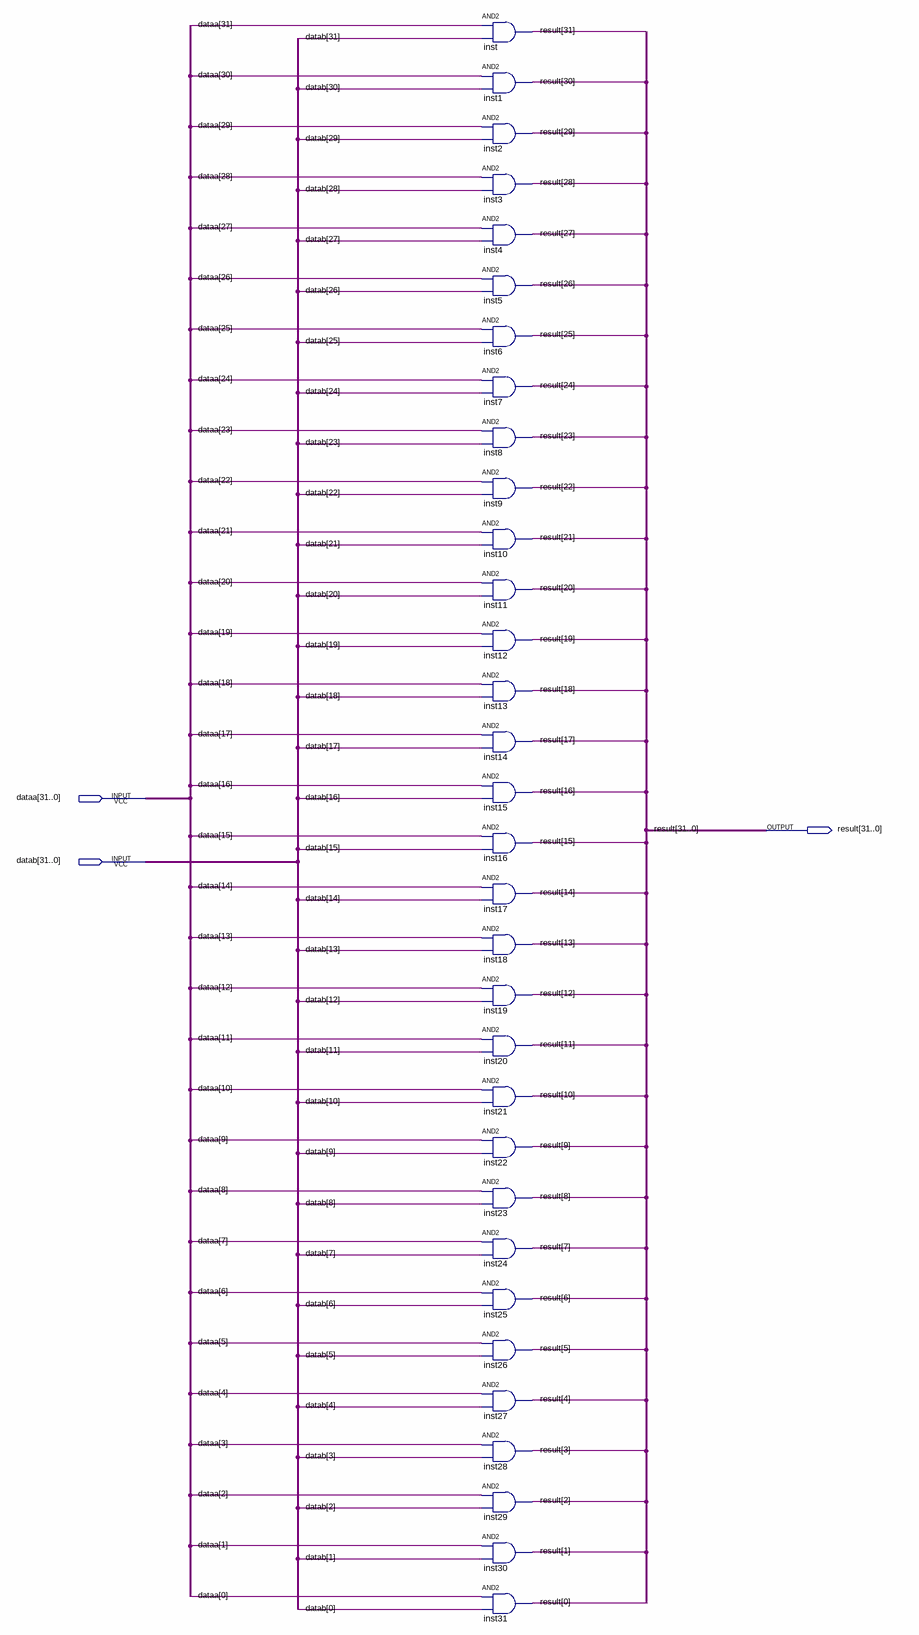
[diagram p0: schematic sheet]
// Quartus schematic ula_and.bdf as structural Verilog: 32 symbols, 3 pins
module ula_and (
  input  [31:0] dataa,
  input  [31:0] datab,
  output [31:0] result
);

  and inst (result[31], dataa[31], datab[31]);
  and inst1 (result[30], dataa[30], datab[30]);
  and inst2 (result[29], dataa[29], datab[29]);
  and inst3 (result[28], dataa[28], datab[28]);
  and inst4 (result[27], dataa[27], datab[27]);
  and inst5 (result[26], dataa[26], datab[26]);
  and inst6 (result[25], dataa[25], datab[25]);
  and inst7 (result[24], dataa[24], datab[24]);
  and inst8 (result[23], dataa[23], datab[23]);
  and inst9 (result[22], dataa[22], datab[22]);
  and inst10 (result[21], dataa[21], datab[21]);
  and inst11 (result[20], dataa[20], datab[20]);
  and inst12 (result[19], dataa[19], datab[19]);
  and inst13 (result[18], dataa[18], datab[18]);
  and inst14 (result[17], dataa[17], datab[17]);
  and inst15 (result[16], dataa[16], datab[16]);
  and inst16 (result[15], dataa[15], datab[15]);
  and inst17 (result[14], dataa[14], datab[14]);
  and inst18 (result[13], dataa[13], datab[13]);
  and inst19 (result[12], dataa[12], datab[12]);
  and inst20 (result[11], dataa[11], datab[11]);
  and inst21 (result[10], dataa[10], datab[10]);
  and inst22 (result[9], dataa[9], datab[9]);
  and inst23 (result[8], dataa[8], datab[8]);
  and inst24 (result[7], dataa[7], datab[7]);
  and inst25 (result[6], dataa[6], datab[6]);
  and inst26 (result[5], dataa[5], datab[5]);
  and inst27 (result[4], dataa[4], datab[4]);
  and inst28 (result[3], dataa[3], datab[3]);
  and inst29 (result[2], dataa[2], datab[2]);
  and inst30 (result[1], dataa[1], datab[1]);
  and inst31 (result[0], dataa[0], datab[0]);
endmodule
